# Altium schematic sheet Sheet1.SchDoc
size A2
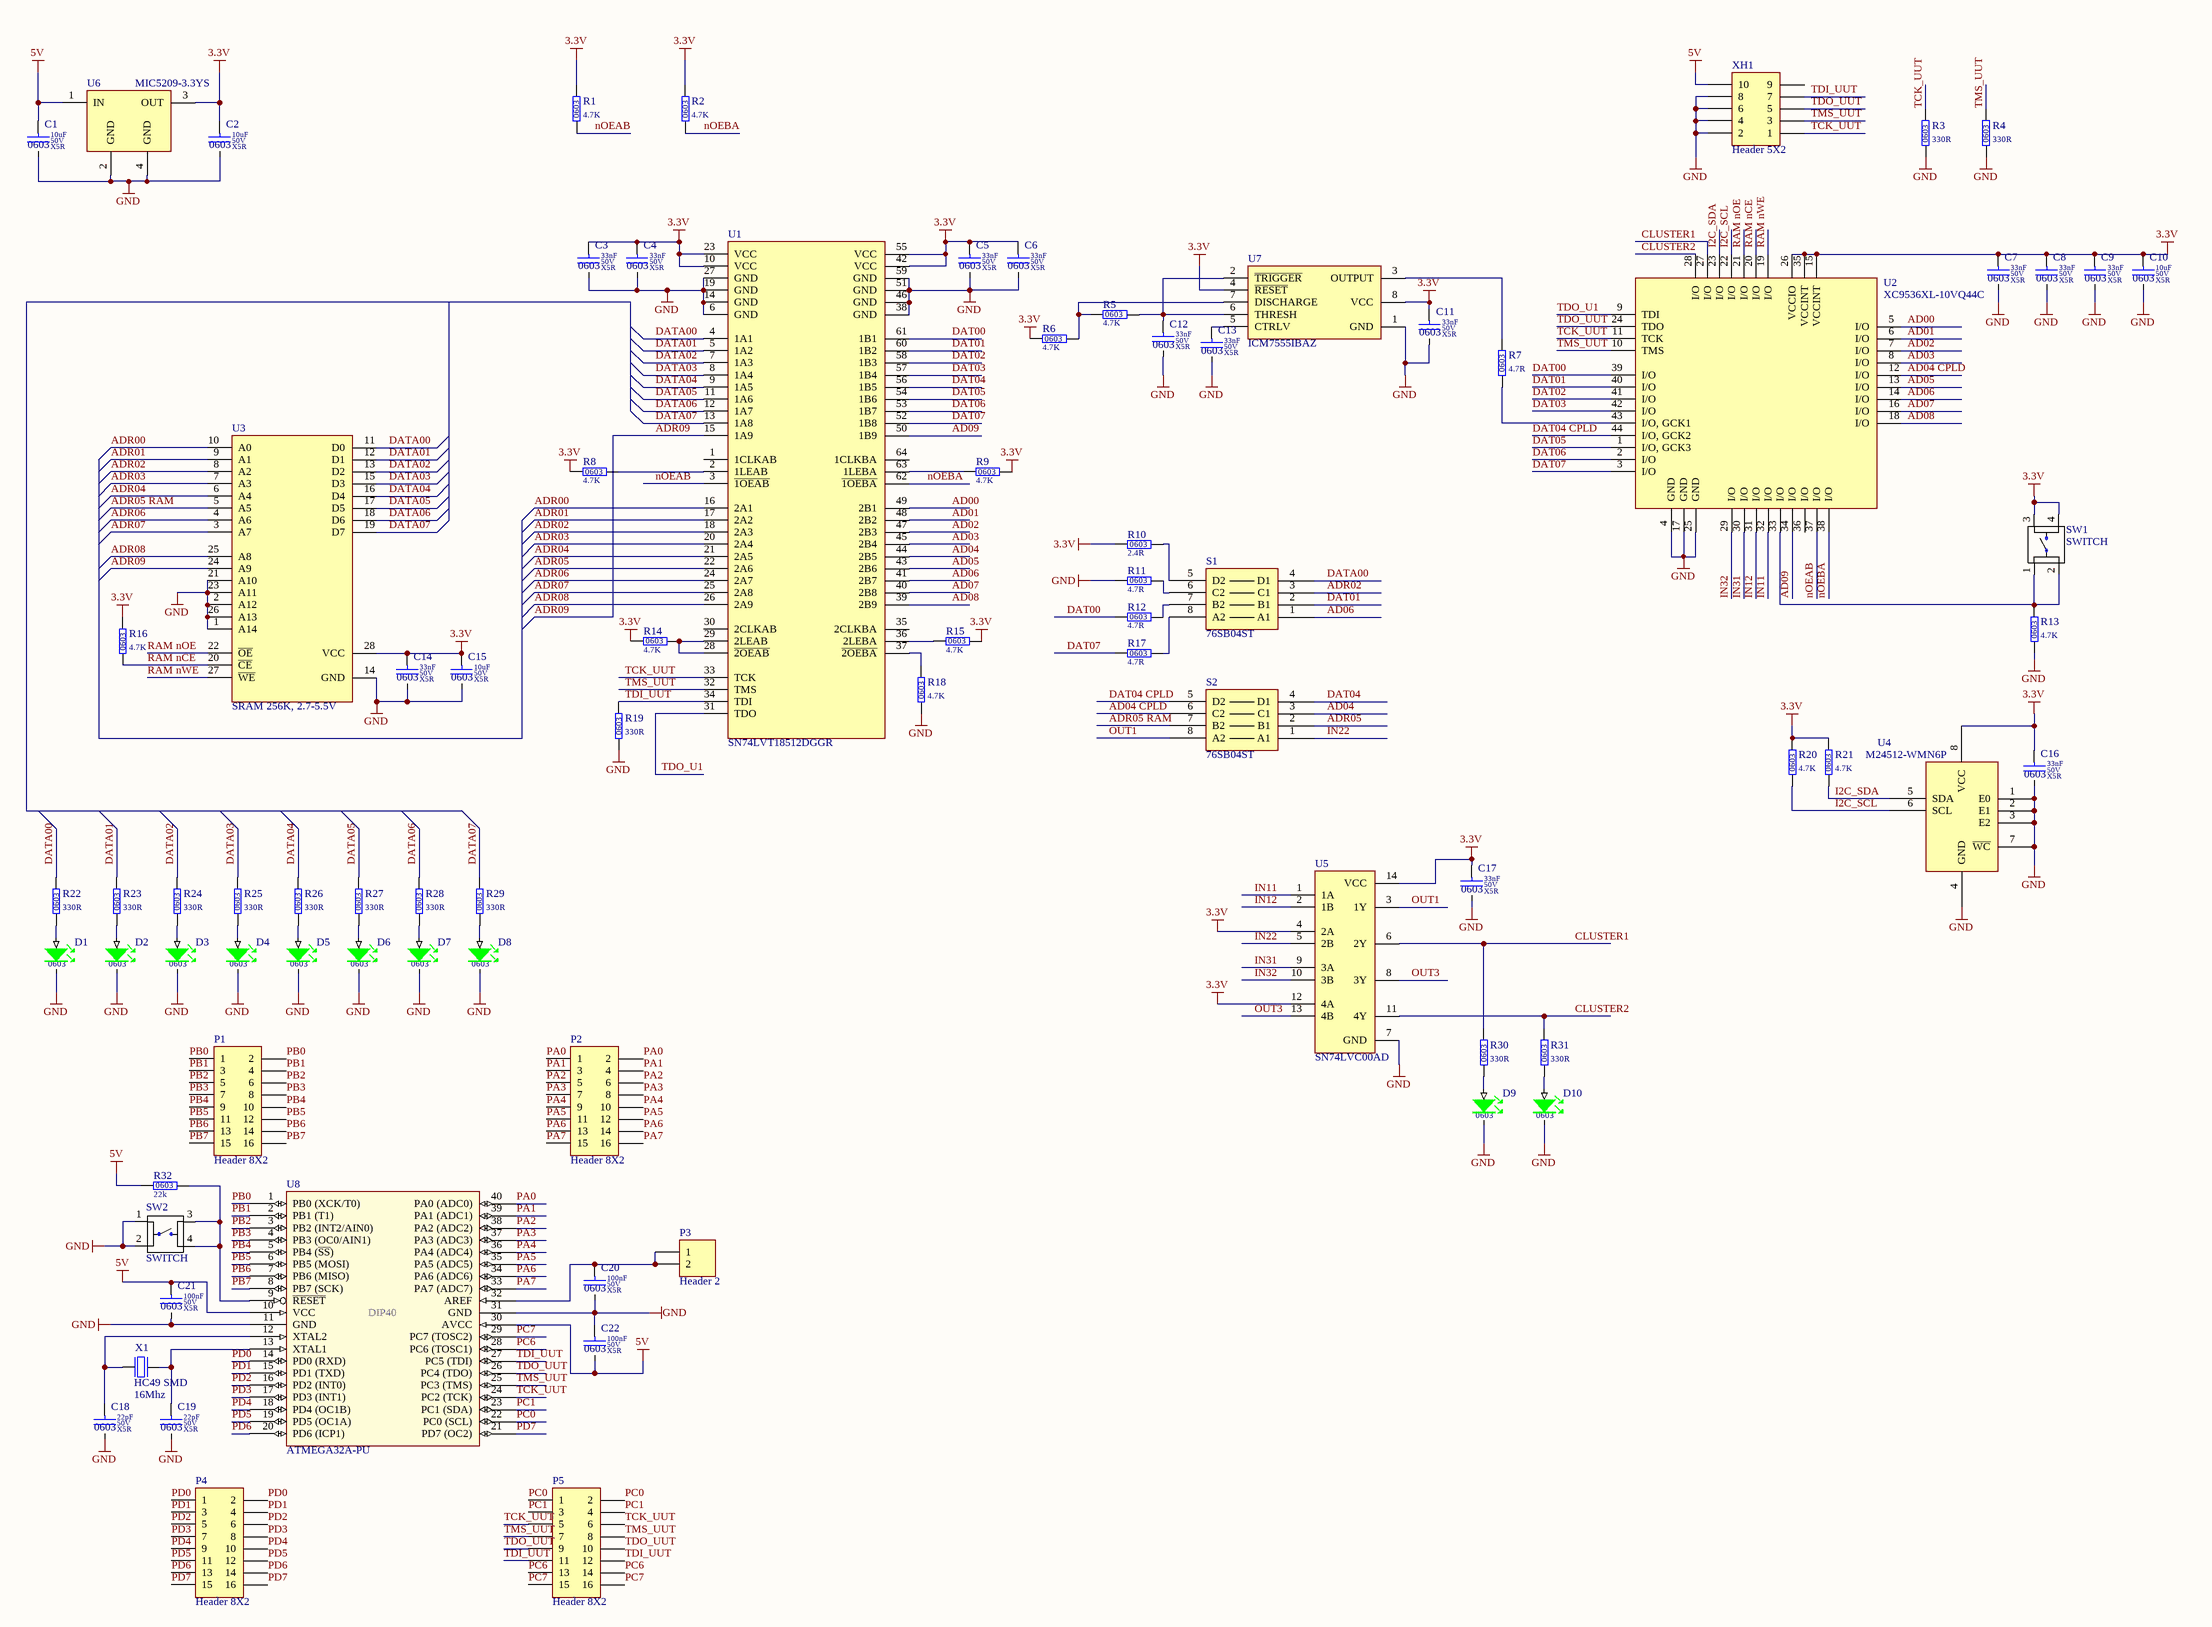
[diagram p0: Sheet1.SchDoc]

## Parts
C1  value 10uF  Dielectric: X5R  Voltage: 50V  SCH_Footprint: 0603  [C_0603]  (hidden comment: Ceramic X5R)
C2  value 10uF  Dielectric: X5R  Voltage: 50V  SCH_Footprint: 0603  [C_0603]  (hidden comment: Ceramic X5R)
C3  value 33nF  Dielectric: X5R  Voltage: 50V  SCH_Footprint: 0603  [C_0603]  (hidden comment: Ceramic X5R)
C4  value 33nF  Dielectric: X5R  Voltage: 50V  SCH_Footprint: 0603  [C_0603]  (hidden comment: Ceramic X5R)
C5  value 33nF  Dielectric: X5R  Voltage: 50V  SCH_Footprint: 0603  [C_0603]  (hidden comment: Ceramic X5R)
C6  value 33nF  Dielectric: X5R  Voltage: 50V  SCH_Footprint: 0603  [C_0603]  (hidden comment: Ceramic X5R)
C7  value 33nF  Dielectric: X5R  Voltage: 50V  SCH_Footprint: 0603  [C_0603]  (hidden comment: Ceramic X5R)
C8  value 33nF  Dielectric: X5R  Voltage: 50V  SCH_Footprint: 0603  [C_0603]  (hidden comment: Ceramic X5R)
C9  value 33nF  Dielectric: X5R  Voltage: 50V  SCH_Footprint: 0603  [C_0603]  (hidden comment: Ceramic X5R)
C10  value 10uF  Dielectric: X5R  Voltage: 50V  SCH_Footprint: 0603  [C_0603]  (hidden comment: Ceramic X5R)
C11  value 33nF  Dielectric: X5R  Voltage: 50V  SCH_Footprint: 0603  [C_0603]  (hidden comment: Ceramic X5R)
C12  value 33nF  Dielectric: X5R  Voltage: 50V  SCH_Footprint: 0603  [C_0603]  (hidden comment: Ceramic X5R)
C13  value 33nF  Dielectric: X5R  Voltage: 50V  SCH_Footprint: 0603  [C_0603]  (hidden comment: Ceramic X5R)
C14  value 33nF  Dielectric: X5R  Voltage: 50V  SCH_Footprint: 0603  [C_0603]  (hidden comment: Ceramic X5R)
C15  value 10uF  Dielectric: X5R  Voltage: 50V  SCH_Footprint: 0603  [C_0603]  (hidden comment: Ceramic X5R)
C16  value 33nF  Dielectric: X5R  Voltage: 50V  SCH_Footprint: 0603  [C_0603]  (hidden comment: Ceramic X5R)
C17  value 33nF  Dielectric: X5R  Voltage: 50V  SCH_Footprint: 0603  [C_0603]  (hidden comment: Ceramic X5R)
C18  value 22pF  Dielectric: X5R  Voltage: 50V  SCH_Footprint: 0603  [C_0603]  (hidden comment: Ceramic X5R)
C19  value 22pF  Dielectric: X5R  Voltage: 50V  SCH_Footprint: 0603  [C_0603]  (hidden comment: Ceramic X5R)
C20  value 100nF  Dielectric: X5R  Voltage: 50V  SCH_Footprint: 0603  [C_0603]  (hidden comment: Ceramic X5R)
C21  value 100nF  Dielectric: X5R  Voltage: 50V  SCH_Footprint: 0603  [C_0603]  (hidden comment: Ceramic X5R)
C22  value 100nF  Dielectric: X5R  Voltage: 50V  SCH_Footprint: 0603  [C_0603]  (hidden comment: Ceramic X5R)
D1  SCH_Footprint: 0603  [OL_0603_1608]  (hidden comment: Green Led)
D2  SCH_Footprint: 0603  [OL_0603_1608]  (hidden comment: Green Led)
D3  SCH_Footprint: 0603  [OL_0603_1608]  (hidden comment: Green Led)
D4  SCH_Footprint: 0603  [OL_0603_1608]  (hidden comment: Green Led)
D5  SCH_Footprint: 0603  [OL_0603_1608]  (hidden comment: Green Led)
D6  SCH_Footprint: 0603  [OL_0603_1608]  (hidden comment: Green Led)
D7  SCH_Footprint: 0603  [OL_0603_1608]  (hidden comment: Green Led)
D8  SCH_Footprint: 0603  [OL_0603_1608]  (hidden comment: Green Led)
D9  SCH_Footprint: 0603  [OL_0603_1608]  (hidden comment: Green Led)
D10  SCH_Footprint: 0603  [OL_0603_1608]  (hidden comment: Green Led)
P1  Header 8X2  [HDR2X8]
P2  Header 8X2  [HDR2X8]
P3  Header 2  [HDR1X2]
P4  Header 8X2  [HDR2X8]
P5  Header 8X2  [HDR2X8]
R1  value 4.7K  SCH_Footprint: 0603  [R_0603]  (hidden comment: Resistor)
R2  value 4.7K  SCH_Footprint: 0603  [R_0603]  (hidden comment: Resistor)
R3  value 330R  SCH_Footprint: 0603  [R_0603]  (hidden comment: Resistor)
R4  value 330R  SCH_Footprint: 0603  [R_0603]  (hidden comment: Resistor)
R5  value 4.7K  SCH_Footprint: 0603  [R_0603]  (hidden comment: Resistor)
R6  value 4.7K  SCH_Footprint: 0603  [R_0603]  (hidden comment: Resistor)
R7  value 4.7R  SCH_Footprint: 0603  [R_0603]  (hidden comment: Resistor)
R8  value 4.7K  SCH_Footprint: 0603  [R_0603]  (hidden comment: Resistor)
R9  value 4.7K  SCH_Footprint: 0603  [R_0603]  (hidden comment: Resistor)
R10  value 2.4R  SCH_Footprint: 0603  [R_0603]  (hidden comment: Resistor)
R11  value 4.7R  SCH_Footprint: 0603  [R_0603]  (hidden comment: Resistor)
R12  value 4.7R  SCH_Footprint: 0603  [R_0603]  (hidden comment: Resistor)
R13  value 4.7K  SCH_Footprint: 0603  [R_0603]  (hidden comment: Resistor)
R14  value 4.7K  SCH_Footprint: 0603  [R_0603]  (hidden comment: Resistor)
R15  value 4.7K  SCH_Footprint: 0603  [R_0603]  (hidden comment: Resistor)
R16  value 4.7K  SCH_Footprint: 0603  [R_0603]  (hidden comment: Resistor)
R17  value 4.7R  SCH_Footprint: 0603  [R_0603]  (hidden comment: Resistor)
R18  value 4.7K  SCH_Footprint: 0603  [R_0603]  (hidden comment: Resistor)
R19  value 330R  SCH_Footprint: 0603  [R_0603]  (hidden comment: Resistor)
R20  value 4.7K  SCH_Footprint: 0603  [R_0603]  (hidden comment: Resistor)
R21  value 4.7K  SCH_Footprint: 0603  [R_0603]  (hidden comment: Resistor)
R22  value 330R  SCH_Footprint: 0603  [R_0603]  (hidden comment: Resistor)
R23  value 330R  SCH_Footprint: 0603  [R_0603]  (hidden comment: Resistor)
R24  value 330R  SCH_Footprint: 0603  [R_0603]  (hidden comment: Resistor)
R25  value 330R  SCH_Footprint: 0603  [R_0603]  (hidden comment: Resistor)
R26  value 330R  SCH_Footprint: 0603  [R_0603]  (hidden comment: Resistor)
R27  value 330R  SCH_Footprint: 0603  [R_0603]  (hidden comment: Resistor)
R28  value 330R  SCH_Footprint: 0603  [R_0603]  (hidden comment: Resistor)
R29  value 330R  SCH_Footprint: 0603  [R_0603]  (hidden comment: Resistor)
R30  value 330R  SCH_Footprint: 0603  [R_0603]  (hidden comment: Resistor)
R31  value 330R  SCH_Footprint: 0603  [R_0603]  (hidden comment: Resistor)
R32  value 22k  SCH_Footprint: 0603  [R_0603]  (hidden comment: Resistor)
S1  76SB04ST  [DIP8_sw]
S2  76SB04ST  [DIP8_sw]
SW1  SWITCH  [switch]
SW2  SWITCH  [switch]
U1  SN74LVT18512DGGR  [TSSOP50P810X105-64N]
U2  XC9536XL-10VQ44C  [TQFP80P1200X1200X120-44N]
U3  SRAM 256K, 2.7-5.5V  [DIP28]
U4  M24512-WMN6P  [SOIC127P600X171-8N]
U5  SN74LVC00AD  [SOIC127P600X175-14N]
U6  MIC5209-3.3YS  [SOT230P700X180-4N]
U7  ICM7555IBAZ  [SOIC127P600X171-8N]
U8  SCH_Footprint: DIP40  [DIP40_SOCKET]  (hidden comment: ATMEGA32A-PU)
X1  value 16Mhz  SCH_Footprint: HC49 SMD  [X_HC49_SMD]  (hidden comment: 16Mhz crystal)
XH1  Header 5X2  [HDR2X5]

## Nets
3.3V: C2.1 C3.1 C4.1 C5.1 C6.1 C7.1 C8.1 C9.1 C10.1 C11.1 C14.1 C15.1 C16.1 C17.1 R1.2 R2.2 R6.1 R8.1 R9.2 R10.1 R14.1 R15.2 R16.2 R20.2 R21.2 SW1.3 SW1.4 U1.10(VCC) U1.23(VCC) U1.42(VCC) U1.55(VCC) U2.15(VCCINT) U2.26(VCCIO) U2.35(VCCINT) U3.28(VCC) U4.8(VCC) U5.4(2A) U5.12(4A) U5.14(VCC) U6.3(OUT) U7.4(~{RESET}) U7.8(VCC)
5V: C1.1 C21.1 C22.2 R32.1 U6.1(IN) U8.10(VCC) U8.30(AVCC) XH1.10
GND: C1.2 C2.2 C3.2 C4.2 C5.2 C6.2 C7.2 C8.2 C9.2 C10.2 C11.2 C12.2 C13.2 C14.2 C15.2 C16.2 C17.2 C18.2 C19.2 C20.2 C21.2 C22.1 D1.1(K) D2.1(K) D3.1(K) D4.1(K) D5.1(K) D6.1(K) D7.1(K) D8.1(K) D9.1(K) D10.1(K) R3.1 R4.1 R11.1 R13.1 R18.1 R19.1 SW2.1 SW2.2 U1.6(GND) U1.14(GND) U1.19(GND) U1.27(GND) U1.38(GND) U1.46(GND) U1.51(GND) U1.59(GND) U2.4(GND) U2.17(GND) U2.25(GND) U3.1(A14) U3.2(A12) U3.14(GND) U3.21(A10) U3.23(A11) U3.26(A13) U4.1(E0) U4.2(E1) U4.3(E2) U4.4(GND) U4.7(~{WC}) U5.7(GND) U6.2(GND) U6.4(GND) U7.1(GND) U8.11(GND) U8.31(GND) XH1.2 XH1.4 XH1.6 XH1.8
AD00: U1.49(2B1) U2.5(I/O)
AD01: U1.48(2B2) U2.6(I/O)
AD02: U1.47(2B3) U2.7(I/O)
AD03: U1.45(2B4) U2.8(I/O)
AD04: S2.3(C1) U1.44(2B5)
AD04 CPLD: S2.6(C2) U2.12(I/O)
AD05: U1.43(2B6) U2.13(I/O)
AD06: S1.1(A1) U1.41(2B7) U2.14(I/O)
AD07: U1.40(2B8) U2.16(I/O)
AD08: U1.39(2B9) U2.18(I/O)
AD09: U1.50(1B9) U2.34(I/O)
ADR00: U1.16(2A1) U3.10(A0)
ADR01: U1.17(2A2) U3.9(A1)
ADR02: S1.3(C1) U1.18(2A3) U3.8(A2)
ADR03: U1.20(2A4) U3.7(A3)
ADR04: U1.21(2A5) U3.6(A4)
ADR05: S2.2(B1) U1.22(2A6)
ADR05 RAM: S2.7(B2) U3.5(A5)
ADR06: U1.24(2A7) U3.4(A6)
ADR07: U1.25(2A8) U3.3(A7)
ADR08: U1.26(2A9) U3.25(A8)
ADR09: U1.15(1A9) U3.24(A9)
CLUSTER1: R30.2 U2.27(I/O) U5.6(2Y)
CLUSTER2: R31.2 U2.28(I/O) U5.11(4Y)
DAT00: R12.1 U1.61(1B1) U2.39(I/O)
DAT01: S1.2(B1) U1.60(1B2) U2.40(I/O)
DAT02: U1.58(1B3) U2.41(I/O)
DAT03: U1.57(1B4) U2.42(I/O)
DAT04: S2.4(D1) U1.56(1B5)
DAT04 CPLD: S2.5(D2) U2.44(I/O,_GCK2)
DAT05: U1.54(1B6) U2.1(I/O,_GCK3)
DAT06: U1.53(1B7) U2.2(I/O)
DAT07: R17.1 U1.52(1B8) U2.3(I/O)
DATA00: R22.2 S1.4(D1) U1.4(1A1) U3.11(D0)
DATA01: R23.2 U1.5(1A2) U3.12(D1)
DATA02: R24.2 U1.7(1A3) U3.13(D2)
DATA03: R25.2 U1.8(1A4) U3.15(D3)
DATA04: R26.2 U1.9(1A5) U3.16(D4)
DATA05: R27.2 U1.11(1A6) U3.17(D5)
DATA06: R28.2 U1.12(1A7) U3.18(D6)
DATA07: R29.2 U1.13(1A8) U3.19(D7)
I2C_SCL: R20.1 U2.22(I/O) U4.6(SCL)
I2C_SDA: R21.1 U2.23(I/O) U4.5(SDA)
IN11: U2.32(I/O) U5.1(1A)
IN12: U2.31(I/O) U5.2(1B)
IN22: S2.1(A1) U5.5(2B)
IN31: U2.30(I/O) U5.9(3A)
IN32: U2.29(I/O) U5.10(3B)
nOEAB: R1.1 U1.3(~{1OEAB}) U2.37(I/O)
nOEBA: R2.1 U1.62(~{1OEBA}) U2.38(I/O)
OUT1: S2.8(A2) U5.3(1Y)
OUT3: U5.8(3Y) U5.13(4B)
PA0: P2.1 P2.2 U8.40(PA0_(ADC0))
PA1: P2.3 P2.4 U8.39(PA1_(ADC1))
PA2: P2.5 P2.6 U8.38(PA2_(ADC2))
PA3: P2.7 P2.8 U8.37(PA3_(ADC3))
PA4: P2.9 P2.10 U8.36(PA4_(ADC4))
PA5: P2.11 P2.12 U8.35(PA5_(ADC5))
PA6: P2.13 P2.14 U8.34(PA6_(ADC6))
PA7: P2.15 P2.16 U8.33(PA7_(ADC7))
PB0: P1.1 P1.2 U8.1(PB0_(XCK/T0))
PB1: P1.3 P1.4 U8.2(PB1_(T1))
PB2: P1.5 P1.6 U8.3(PB2_(INT2/AIN0))
PB3: P1.7 P1.8 U8.4(PB3_(OC0/AIN1))
PB4: P1.9 P1.10 U8.5(PB4_(~{SS}))
PB5: P1.11 P1.12 U8.6(PB5_(MOSI))
PB6: P1.13 P1.14 U8.7(PB6_(MISO))
PB7: P1.15 P1.16 U8.8(PB7_(SCK))
PC0: P5.1 P5.2 U8.22(PC0_(SCL))
PC1: P5.3 P5.4 U8.23(PC1_(SDA))
PC6: P5.13 P5.14 U8.28(PC6_(TOSC1))
PC7: P5.15 P5.16 U8.29(PC7_(TOSC2))
PD0: P4.1 P4.2 U8.14(PD0_(RXD))
PD1: P4.3 P4.4 U8.15(PD1_(TXD))
PD2: P4.5 P4.6 U8.16(PD2_(INT0))
PD3: P4.7 P4.8 U8.17(PD3_(INT1))
PD4: P4.9 P4.10 U8.18(PD4_(OC1B))
PD5: P4.11 P4.12 U8.19(PD5_(OC1A))
PD6: P4.13 P4.14 U8.20(PD6_(ICP1))
PD7: P4.15 P4.16 U8.21(PD7_(OC2))
RAM nCE: R16.1 U2.20(I/O) U3.20(~{CE})
RAM nOE: U2.21(I/O) U3.22(~{OE})
RAM nWE: U2.19(I/O) U3.27(~{WE})
TCK_UUT: P5.5 P5.6 R3.2 U1.33(TCK) U2.11(TCK) U8.24(PC2_(TCK)) XH1.1
TDI_UUT: P5.11 P5.12 R19.2 U1.34(TDI) U8.27(PC5_(TDI)) XH1.7
TDO_U1: U1.31(TDO) U2.9(TDI)
TDO_UUT: P5.9 P5.10 U2.24(TDO) U8.26(PC4_(TDO)) XH1.5
TMS_UUT: P5.7 P5.8 R4.2 U1.32(TMS) U2.10(TMS) U8.25(PC3_(TMS)) XH1.3
NetC12_1: C12.1 R5.2 U7.2(~{TRIGGER}) U7.6(THRESH)
NetC13_1: C13.1 U7.5(CTRLV)
NetC18_1: C18.1 U8.12(XTAL2) X1.1
NetC19_1: C19.1 U8.13(XTAL1) X1.2
NetC20_1: C20.1 P3.1 P3.2 U8.32(AREF)
NetD1_2: D1.2(A) R22.1
NetD2_2: D2.2(A) R23.1
NetD3_2: D3.2(A) R24.1
NetD4_2: D4.2(A) R25.1
NetD5_2: D5.2(A) R26.1
NetD6_2: D6.2(A) R27.1
NetD7_2: D7.2(A) R28.1
NetD8_2: D8.2(A) R29.1
NetD9_2: D9.2(A) R30.1
NetD10_2: D10.2(A) R31.1
NetR5_1: R5.1 R6.2 U7.7(DISCHARGE)
NetR7_1: R7.1 U2.43(I/O,_GCK1)
NetR7_2: R7.2 U7.3(OUTPUT)
NetR8_2: R8.2 U1.2(1LEAB)
NetR9_1: R9.1 U1.63(1LEBA)
NetR10_2: R10.2 S1.5(D2)
NetR11_2: R11.2 S1.6(C2)
NetR12_2: R12.2 S1.7(B2)
NetR13_2: R13.2 SW1.1 SW1.2 U2.33(I/O)
NetR14_2: R14.2 U1.28(~{2OEAB}) U1.29(2LEAB)
NetR15_1: R15.1 U1.36(2LEBA)
NetR17_2: R17.2 S1.8(A2)
NetR18_2: R18.2 U1.37(~{2OEBA})
NetR32_2: R32.2 SW2.3 SW2.4 U8.9(~{RESET})

Not connected (* = marked no-connect by the designer): U1 1(1CLKAB) 30(2CLKAB) 35(2CLKBA) 64(1CLKBA); U2 36(I/O); XH1 9

## Library data of the parts
C1 C2 C10 C15 = C_10uF_50V_X5R_0603_10: Capacitor; Tolerance: 10%; Part Number: C_10uF_50V_X5R_0603_10; Supplier part number 1: 0
C3-C9 C11-C14 C16 C17 = C_33nF_50V_X5R_0603_10: Capacitor; Tolerance: 10%; Part Number: C_33nF_50V_X5R_0603_10; Supplier part number 1: 0
C18 C19 = C_22pF_50V_X5R_0603_10: Capacitor; Tolerance: 10%; Part Number: C_22pF_50V_X5R_0603_10; Supplier part number 1: 0
C20-C22 = C_100nF_50V_X5R_0603_10: Capacitor; Tolerance: 10%; Part Number: C_100nF_50V_X5R_0603_10; Supplier part number 1: 0
D1-D10 = OL_G_0603: LED GREEN; Manufacturer: Lite-On; Manufacturer Part Number: LTST-C190TGKT; Part Number: OL_G_0603; HelpURL: https://datasheet.octopart.com/LTST-C190TGKT-Lite-On-datasheet-158437.pdf; Supplier 1: TME; Supplier Part Number 1: LTST-C190TGKT; Supplier 2: RS Components; Supplier Part Number 2: 6920997P; Supplier 3: Farnell; Supplier 4: Mouser; Supplier Part Number 4: 859-LTST-C190TGKT; Supplier 5: Digi-Key; Supplier Part Number 5: 160-2019-1-ND
P1 P2 P4 P5 = Header 8X2: Header, 8-Pin, Dual row; LatestRevisionDate: 17-Jul-2002; LatestRevisionNote: Re-released for DXP Platform.; Publisher: Altium Limited
P3 = Header 2: Header, 2-Pin; LatestRevisionDate: 17-Jul-2002; LatestRevisionNote: Re-released for DXP Platform.; Publisher: Altium Limited
R1 R2 R5 R6 R8 R9 R13-R16 R18 R20 R21 = R_4.7k_0603_5: Tolerance: 5%; Power: 100mW; Voltage: 50V; Part number: R_4.7k_0603_5
R3 R4 R19 R22-R31 = R_330R_0603_5: Tolerance: 5%; Power: 100mW; Voltage: 50V; Part number: R_330R_0603_5
R7 R11 R12 R17 = R_4.7R_0603_5: Tolerance: 5%; Power: 100mW; Voltage: 50V; Part number: R_4.7R_0603_5
R10 = R_2.4R_0603_5: Tolerance: 5%; Power: 100mW; Voltage: 50V; Part number: R_2.4R_0603_5
R32 = R_22k_0603_5: Tolerance: 5%; Power: 100mW; Voltage: 50V; Part number: R_22k_0603_5
S1 S2 = 76SB04ST: GRAYHILL         76SB04ST             DIP / SIP Switch, 76 Series, SPST, Through Hole, 4 Circuits, DIP Sealed, 30 VDC; Body Material: Thermoplastic; Mechanical Life: 2000Cycles; Max Voltage Rating (DC): 30V; Number of Positions: 4; Max Current Rating: 150mA; Insulation Resistance: 5GR; Actuator Type: Rocker; Pitch: 0.1inch; Lead Length: 3.96mm; Actuator Length: 0.58mm; Washable: Yes; Supplier 1: Digi-Key; Manufacturer 1: Grayhill; Manufacturer Part Number 1: 76SB04ST; Stock 1: 9210; Pricing 1: 1=1,30000, 21=1,22524, 42=1,17500, 63=1,10000, 105=1,07505, 252=0,95000, 504=0,90000, 1008=0,80000, 5019=0,70000 (USD); RoHS: Yes; Mount: Through Hole; Contact Material: Copper Alloy; Contact Plating: Gold; Min Operating Temperature: -40°C; Max Operating Temperature: 85°C; Throw Configuration: SPST; Termination: PC Pins; Voltage Rating (DC): 30V; Packaging: Rail/Tube; Current Rating: 150mA; Contact Current Rating: 150mA; Electrical Life: 2000Cycles; Number of Circuits: 4; Orientation: Straight; Length: 0.48inch; Terminal Pitch: 2.54mm; Depth: 9.65mm; Radiation Hardening: No; REACH SVHC: No SVHC; Lead Free: Lead Free; ComponentLink1URL: https://datasheet.ciiva.com/2864/dip-series-76-spst-2864336.pdf?src-supplier=Digi-Key; ComponentLink1Description: https://datasheet.ciiva.com/2864/dip-series-76-spst-2864336.pdf?src-supplier=Digi-Key; ComponentLink2URL: https://datasheet.ciiva.com/14542/70216655-14542680.pdf?src-supplier=Allied+Electronics; ComponentLink2Description: https://datasheet.ciiva.com/14542/70216655-14542680.pdf?src-supplier=Allied+Electronics; ComponentLink3URL: https://datasheet.ciiva.com/15226/getdatasheetpartid-90859-15226682.pdf?src-supplier=Verical; ComponentLink3Description: https://datasheet.ciiva.com/15226/getdatasheetpartid-90859-15226682.pdf?src-supplier=Verical; ComponentLink4URL: https://datasheet.ciiva.com/1528/1884225-1528972.pdf?src-supplier=Element14; ComponentLink4Description: https://datasheet.ciiva.com/1528/1884225-1528972.pdf?src-supplier=Element14; ComponentLink5URL: https://datasheet.ciiva.com/16507/dip-series-76-spst-16507935.pdf?src-supplier=Future+Electronics; ComponentLink5Description: https://datasheet.ciiva.com/16507/dip-series-76-spst-16507935.pdf?src-supplier=Future+Electronics; Supplier Part Number 1: GH7169-ND
U1 = SN74LVT18512DGGR: IC SCAN TEST UNIV TXRX 64TSSOP; Manufacturer 1: Texas Instruments; Operating Supply Voltage: 3.3V; Propagation Delay: 20ns; Number of Channels: 18; Min Supply Voltage: 2.7V; Max Supply Voltage: 3.6V; Number of Elements: 2; Direction: Bidirectional; Polarity: Non-Inverting; Logic Function: Transceiver; Quiescent Current: 18mA; High Level Output Current: 64mA; Low Level Output Current: 32mA; Supplier 1: Digi-Key; Manufacturer Part Number 1: SN74LVT18512DGGR; Stock 1: 406; Pricing 1: 1=7,61000, 10=6,87800, 100=5,69450, 500=4,95872, 1000=4,31889 (USD); RoHS: Yes; Mount: Surface Mount; Case/Package: TSSOP; Number of Pins: 64; Weight: 0.009263oz; Contact Plating: Gold; Min Operating Temperature: -40°C; Max Operating Temperature: 85°C; Number of Bits: 18; Package Quantity: 1; Packaging: Tape and Reel; Turn-On Delay Time: 20ns; Number of Outputs: 18; Radiation Hardening: No; Lead Free: Lead Free; ComponentLink1URL: https://datasheet.ciiva.com/1902/sn74lvt18512-1902320.pdf?src-supplier=Digi-Key; ComponentLink1Description: https://datasheet.ciiva.com/1902/sn74lvt18512-1902320.pdf?src-supplier=Digi-Key; ComponentLink2URL: https://datasheet.ciiva.com/26868/sn74lvt18512dggr-26868445.pdf?src-supplier=IIIC; ComponentLink2Description: https://datasheet.ciiva.com/26868/sn74lvt18512dggr-26868445.pdf?src-supplier=IIIC; ComponentLink3URL: https://datasheet.ciiva.com/1902/sn74lvt18512-1902321.pdf?src-supplier=Digi-Key; ComponentLink3Description: https://datasheet.ciiva.com/1902/sn74lvt18512-1902321.pdf?src-supplier=Digi-Key; ComponentLink4URL: https://datasheet.ciiva.com/1902/sn74lvt18512-1902322.pdf?src-supplier=Digi-Key; ComponentLink4Description: https://datasheet.ciiva.com/1902/sn74lvt18512-1902322.pdf?src-supplier=Digi-Key; Supplier Part Number 1: 296-8646-1-ND
U2 = XC9536XL-10VQ44C: IC CPLD 36MC 10NS 44VQFP; Manufacturer 1: Xilinx; Operating Supply Voltage: 3.3V; Speed Grade: 10; Number of Gates: 800; Number of Logic Blocks (LABs): 2; Number of Macrocells: 36; Memory Type: FLASH; Max Frequency: 100MHz; Number of I/Os: 34; Min Supply Voltage: 3V; Max Supply Voltage: 3.6V; Supplier 1: Farnell; Manufacturer Part Number 1: XC9536XL-10VQ44C; Stock 1: 501; RoHS: Yes; Mount: Surface Mount; Case/Package: TQFP; Number of Pins: 44; Contact Plating: Tin; Min Operating Temperature: 0°C; Max Operating Temperature: 70°C; Propagation Delay: 10ns; Packaging: Tray; Package Quantity: 160; Number of Logic Elements/Cells: 2; Turn-On Delay Time: 10ns; Radiation Hardening: No; Lead Free: Contains Lead; ComponentLink1URL: https://datasheet.ciiva.com/1414/ds058-1414037.pdf?src-supplier=Digi-Key; ComponentLink1Description: https://datasheet.ciiva.com/1414/ds058-1414037.pdf?src-supplier=Digi-Key; Supplier Part Number 1: 2984653
U3 = AS6C62256A-70PCN: SRAM 256K, 2.7-5.5V, 70ns 32K x 8 Asynch SRAM; Manufacturer 1: Alliance Memory; Interface: Parallel; Memory Type: RAM; Max Supply Voltage: 5.5V; Min Supply Voltage: 4.5V; Memory Size: 256Kb; Operating Supply Voltage: 5V; Address Bus Width: 15b; Number of Ports: 1; Max Supply Current: 70mA; Supplier 1: Digi-Key; Manufacturer Part Number 1: AS6C62256A-70PCN; Stock 1: 373; Pricing 1: 1=3,20000, 15=2,90267, 30=2,83967, 60=2,82400, 105=2,53257, 255=2,52314, 510=2,43022, 1005=2,31053 (USD); RoHS: Yes; Case/Package: PDIP; Number of Pins: 28; Weight: 0.147798oz; Min Operating Temperature: 0°C; Max Operating Temperature: 70°C; Packaging: Rail/Tube; Package Quantity: 15; Access Time: 70ns; Density: 256Kb; Radiation Hardening: No; Lead Free: Lead Free; ComponentLink1URL: https://datasheet.ciiva.com/3201/as6c62256a-3201045.pdf?src-supplier=Avnet; ComponentLink1Description: https://datasheet.ciiva.com/3201/as6c62256a-3201045.pdf?src-supplier=Avnet; ComponentLink2URL: https://datasheet.ciiva.com/41860/as6c62256a-41860885.pdf?src-supplier=Digi-Key; ComponentLink2Description: https://datasheet.ciiva.com/41860/as6c62256a-41860885.pdf?src-supplier=Digi-Key; ComponentLink3URL: https://datasheet.ciiva.com/16350/as6c62256a-16350847.pdf?src-supplier=Future+Electronics; ComponentLink3Description: https://datasheet.ciiva.com/16350/as6c62256a-16350847.pdf?src-supplier=Future+Electronics; Supplier Part Number 1: 1450-1182-5-ND
U4 = M24512-WMN6P: IC EEPROM 512K I2C 1MHZ 8SO; Manufacturer 1: STMicroelectronics; Access Time: 900ns; Density: 512Kb; Max Frequency: 400kHz; Max Supply Voltage: 5.5V; Min Supply Voltage: 2.5V; Nominal Supply Current: 5mA; Operating Supply Voltage: 5V; Supplier 1: Farnell; Manufacturer Part Number 1: M24512-WMN6P; Stock 1: 2136; RoHS: Yes; Mount: Surface Mount; Case/Package: SOIC; Number of Pins: 8; Min Operating Temperature: -40°C; Max Operating Temperature: 85°C; Interface: I2C; Frequency: 1MHz; Packaging: Rail/Tube; Memory Size: 512Kb; Package Quantity: 2000; Memory Type: EEPROM; Length: 4.9mm; Height: 1.25mm; Width: 3.9mm; Radiation Hardening: No; REACH SVHC: No SVHC; Lead Free: Lead Free; ComponentLink1URL: https://datasheet.ciiva.com/4861/cd00251873-231256-4861208.pdf?src-supplier=Mouser; ComponentLink1Description: https://datasheet.ciiva.com/4861/cd00251873-231256-4861208.pdf?src-supplier=Mouser; ComponentLink2URL: https://datasheet.ciiva.com/15123/getdatasheetpartid-392549-15123433.pdf?src-supplier=Verical; ComponentLink2Description: https://datasheet.ciiva.com/15123/getdatasheetpartid-392549-15123433.pdf?src-supplier=Verical; ComponentLink3URL: https://datasheet.ciiva.com/1925/cd00251873-1925766.pdf?src-supplier=Digi-Key; ComponentLink3Description: https://datasheet.ciiva.com/1925/cd00251873-1925766.pdf?src-supplier=Digi-Key; ComponentLink4URL: https://datasheet.ciiva.com/3185/cd00251873-3185690.pdf?src-supplier=Avnet; ComponentLink4Description: https://datasheet.ciiva.com/3185/cd00251873-3185690.pdf?src-supplier=Avnet; ComponentLink5URL: https://datasheet.ciiva.com/16444/cd00251873-16444943.pdf?src-supplier=Future+Electronics; ComponentLink5Description: https://datasheet.ciiva.com/16444/cd00251873-16444943.pdf?src-supplier=Future+Electronics; Supplier Part Number 1: 1670818
U5 = SN74LVC00AD: IC GATE NAND 4CH 2-INP 14SOIC; Manufacturer 1: Texas Instruments; Number of Gates: 4; Propagation Delay: 4.3ns; Min Supply Voltage: 1.65V; Max Supply Voltage: 3.6V; Output Current: 24mA; Number of Inputs: 2; Number of Outputs: 1; Quiescent Current: 1uA; High Level Output Current: -24mA; Schmitt Trigger Input: No; Supplier 1: Digi-Key; Manufacturer Part Number 1: SN74LVC00AD; Stock 1: 5347; Pricing 1: 1=0,49000, 10=0,39500, 50=0,36120, 100=0,26880, 500=0,20160, 1000=0,15120, 2500=0,13860, 5000=0,13020 (USD); RoHS: Yes; Mount: Surface Mount; Case/Package: SOIC; Number of Pins: 14; Weight: 0.004564oz; Min Operating Temperature: -40°C; Max Operating Temperature: 125°C; Logic Function: NAND; Number of Elements: 4; Packaging: Rail/Tube; Package Quantity: 50; Low Level Output Current: 24mA; Number of Circuits: 4; Number of Input Lines: 2; Number of Output Lines: 1; Number of Bits: 4; Turn-On Delay Time: 4.3ns; Length: 8.65mm; Height: 1.58mm; Width: 3.91mm; Radiation Hardening: No; Lead Free: Lead Free; REACH SVHC: No SVHC; ComponentLink1URL: https://datasheet.ciiva.com/4818/scas279p-110028-4818720.pdf?src-supplier=Mouser; ComponentLink1Description: https://datasheet.ciiva.com/4818/scas279p-110028-4818720.pdf?src-supplier=Mouser; ComponentLink2URL: https://datasheet.ciiva.com/14134/cp648305-e-14134462.pdf?src-supplier=Distrelec; ComponentLink2Description: https://datasheet.ciiva.com/14134/cp648305-e-14134462.pdf?src-supplier=Distrelec; ComponentLink3URL: https://datasheet.ciiva.com/25628/0900766b80b85ff0-25628459.pdf?src-supplier=RSComponents; ComponentLink3Description: https://datasheet.ciiva.com/25628/0900766b80b85ff0-25628459.pdf?src-supplier=RSComponents; ComponentLink4URL: https://datasheet.ciiva.com/15221/getdatasheetpartid-241496-15221861.pdf?src-supplier=Verical; ComponentLink4Description: https://datasheet.ciiva.com/15221/getdatasheetpartid-241496-15221861.pdf?src-supplier=Verical; ComponentLink5URL: https://datasheet.ciiva.com/14290/sn74lvc00a-14290830.pdf?src-supplier=Avnet; ComponentLink5Description: https://datasheet.ciiva.com/14290/sn74lvc00a-14290830.pdf?src-supplier=Avnet; ComponentLink6URL: https://datasheet.ciiva.com/26048/sn74lvc00a-26048399.pdf?src-supplier=Avnet+Europe; ComponentLink6Description: https://datasheet.ciiva.com/26048/sn74lvc00a-26048399.pdf?src-supplier=Avnet+Europe; ComponentLink7URL: https://datasheet.ciiva.com/1869/sn74lvc00a-1869460.pdf?src-supplier=Digi-Key; ComponentLink7Description: https://datasheet.ciiva.com/1869/sn74lvc00a-1869460.pdf?src-supplier=Digi-Key; ComponentLink8URL: https://datasheet.ciiva.com/7948/1834126-7948984.pdf?src-supplier=Element14; ComponentLink8Description: https://datasheet.ciiva.com/7948/1834126-7948984.pdf?src-supplier=Element14; Supplier Part Number 1: 296-1694-5-ND
U6 = MIC5209-3.3YS: IC REG LINEAR 3.3V 500MA SOT223; Manufacturer 1: Microchip Micrel; Dropout Voltage: 350mV; Max Input Voltage: 16V; Min Input Voltage: 2.5V; Number of Regulators: 1; Output Type: Fixed; Polarity: Positive; Output Voltage Accuracy: 1%; Power Supply Rejection Ratio (PSRR): 75dB; Supplier 1: Digi-Key; Manufacturer Part Number 1: MIC5209-3.3YS; Stock 1: 2154; Pricing 1: 1=1,23000, 25=1,01960, 100=0,92700 (USD); RoHS: Yes; Mount: Surface Mount; Case/Package: SOT-223; Number of Pins: 3; Min Operating Temperature: -40°C; Max Operating Temperature: 125°C; Output Current: 500mA; Packaging: Rail/Tube; Output Voltage: 3.3V; Nominal Output Voltage: 3.3V; Number of Outputs: 1; Max Output Current: 500mA; Package Quantity: 78; Min Output Voltage: 3.3V; Accuracy: 1%; Current Rating: 500mA; Length: 6.5mm; Height: 1.6mm; Width: 3.5mm; Radiation Hardening: No; REACH SVHC: No SVHC; Lead Free: Lead Free; ComponentLink1URL: https://datasheet.ciiva.com/2052/mic5209-2052771.pdf?src-supplier=Digi-Key; ComponentLink1Description: https://datasheet.ciiva.com/2052/mic5209-2052771.pdf?src-supplier=Digi-Key; ComponentLink2URL: https://datasheet.ciiva.com/7993/29478-7993545.pdf?src-supplier=Element14; ComponentLink2Description: https://datasheet.ciiva.com/7993/29478-7993545.pdf?src-supplier=Element14; ComponentLink3URL: https://datasheet.ciiva.com/7993/29478-7993546.pdf?src-supplier=Element14; ComponentLink3Description: https://datasheet.ciiva.com/7993/29478-7993546.pdf?src-supplier=Element14; ComponentLink4URL: https://datasheet.ciiva.com/16389/mic5209-16389119.pdf?src-supplier=Future+Electronics; ComponentLink4Description: https://datasheet.ciiva.com/16389/mic5209-16389119.pdf?src-supplier=Future+Electronics; Supplier Part Number 1: 576-3516-5-ND
U7 = ICM7555IBAZ: INTERSIL         ICM7555IBAZ             IC, TIMER CMOS, SMD, 7555, SOIC8; Frequency: 1MHz; Max Supply Voltage: 18V; Min Supply Voltage: 2V; Operating Supply Current: 60uA; Low Level Output Current: 20mA; High Level Output Current: -800uA; Number of Timers/Counters: 1; Current Rating: 300A; Supplier 1: Newark; Manufacturer 1: Intersil; Manufacturer Part Number 1: ICM7555IBAZ; Stock 1: 7411; Pricing 1: 1=0,71000, 10=0,58900, 100=0,38000, 500=0,34200, 1000=0,30400, 2500=0,25700, 10000=0,24800 (USD); RoHS: Yes; Mount: Surface Mount; Case/Package: SOIC; Number of Pins: 8; Min Operating Temperature: -25°C; Max Operating Temperature: 85°C; Packaging: Rail/Tube; Package Quantity: 98; Nominal Supply Current: 60uA; Number of Channels: 1; Length: 5mm; Height: 1.5mm; Width: 4mm; Radiation Hardening: No; Lead Free: Lead Free; REACH SVHC: No SVHC; ComponentLink1URL: https://datasheet.ciiva.com/14094/fe640180-14094962.pdf?src-supplier=Distrelec; ComponentLink1Description: https://datasheet.ciiva.com/14094/fe640180-14094962.pdf?src-supplier=Distrelec; ComponentLink2URL: https://datasheet.ciiva.com/3305/fn2867-3305545.pdf?src-supplier=Avnet; ComponentLink2Description: https://datasheet.ciiva.com/3305/fn2867-3305545.pdf?src-supplier=Avnet; ComponentLink3URL: https://datasheet.ciiva.com/6667/fn2867-6667931.pdf?src-supplier=Digi-Key; ComponentLink3Description: https://datasheet.ciiva.com/6667/fn2867-6667931.pdf?src-supplier=Digi-Key; ComponentLink4URL: https://datasheet.ciiva.com/16538/fn2867-16538076.pdf?src-supplier=Avnet+Europe; ComponentLink4Description: https://datasheet.ciiva.com/16538/fn2867-16538076.pdf?src-supplier=Avnet+Europe; ComponentLink5URL: https://datasheet.ciiva.com/18404/70206838-18404156.pdf?src-supplier=Allied+Electronics; ComponentLink5Description: https://datasheet.ciiva.com/18404/70206838-18404156.pdf?src-supplier=Allied+Electronics; ComponentLink6URL: https://datasheet.ciiva.com/6667/fn2867-6667037.pdf?src-supplier=Digi-Key; ComponentLink6Description: https://datasheet.ciiva.com/6667/fn2867-6667037.pdf?src-supplier=Digi-Key; Supplier Part Number 1: 97K1861
U8 = UP_ATMEGA32A-PU: Manufacturer: Microchip; Part Number: UP_ATMEGA32A-PU; Value: ATMEGA32A-PU; HelpURL: http://ww1.microchip.com/downloads/en/DeviceDoc/ATmega32A-DataSheet-Complete-DS40002072A.pdf; Manufacturer Part Number: ATMEGA32A-PU; Supplier 1: TME; Supplier Part Number 1: ATMEGA32A-PU
X1 = X_HC49_SMD: Resonator Ceramic; Supplier 1: TME; Supplier Part Number 1: HC49USM-FF3F16.00; Supplier 2: RS Components; Supplier 3: Farnell; Supplier 4: Mouser; Supplier 5: Digi-Key; Part Number: X_HC49_SMD
XH1 = Header 5X2: Header, 5-Pin, Dual row; LatestRevisionDate: 17-Jul-2002; LatestRevisionNote: Re-released for DXP Platform.; Publisher: Altium Limited